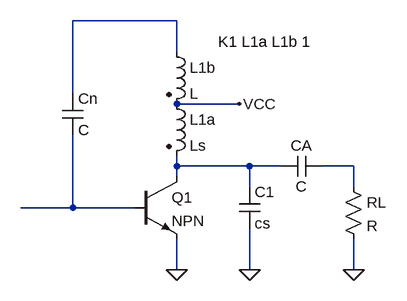
[diagram p0: schematic circuito_base.asc]
circuito_base.asc, the LTspice schematic file:
Version 4
SHEET 1 880 680
WIRE 192 -80 32 -80
WIRE 192 -32 192 -80
WIRE 32 32 32 -80
WIRE 288 48 192 48
WIRE 192 144 192 128
WIRE 304 144 192 144
WIRE 352 144 304 144
WIRE 464 144 416 144
WIRE 192 160 192 144
WIRE 304 176 304 144
WIRE 464 176 464 144
WIRE 32 208 32 96
WIRE 32 208 -48 208
WIRE 128 208 32 208
WIRE 192 304 192 256
WIRE 304 304 304 240
WIRE 464 304 464 256
FLAG 192 304 0
FLAG 304 304 0
FLAG 464 304 0
FLAG 288 48 VCC
SYMBOL npn 128 160 R0
SYMATTR InstName Q1
SYMBOL ind2 176 32 R0
SYMATTR InstName L1a
SYMATTR Value Ls
SYMATTR Type ind
SYMBOL ind2 176 -48 R0
SYMATTR InstName L1b
SYMATTR Type ind
SYMBOL cap 16 32 R0
SYMATTR InstName Cn
SYMBOL cap 288 176 R0
SYMATTR InstName C1
SYMATTR Value cs
SYMBOL res 448 160 R0
SYMATTR InstName RL
SYMBOL cap 416 128 R90
WINDOW 0 0 32 VBottom 2
WINDOW 3 32 32 VTop 2
SYMATTR InstName CA
TEXT 256 -48 Left 2 !K1 L1a L1b 1

The netlist it stands for:
* circuito_base.asc
Q1 N002 N004 0 0 NPN
L1a VCC N002 Ls
L1b N001 VCC L
Cn N001 N004 C
C1 N002 0 cs
RL N003 0 R
CA N003 N002 C
.model NPN NPN
.model PNP PNP
.lib standard.bjt
K1 L1a L1b 1
.backanno
.end